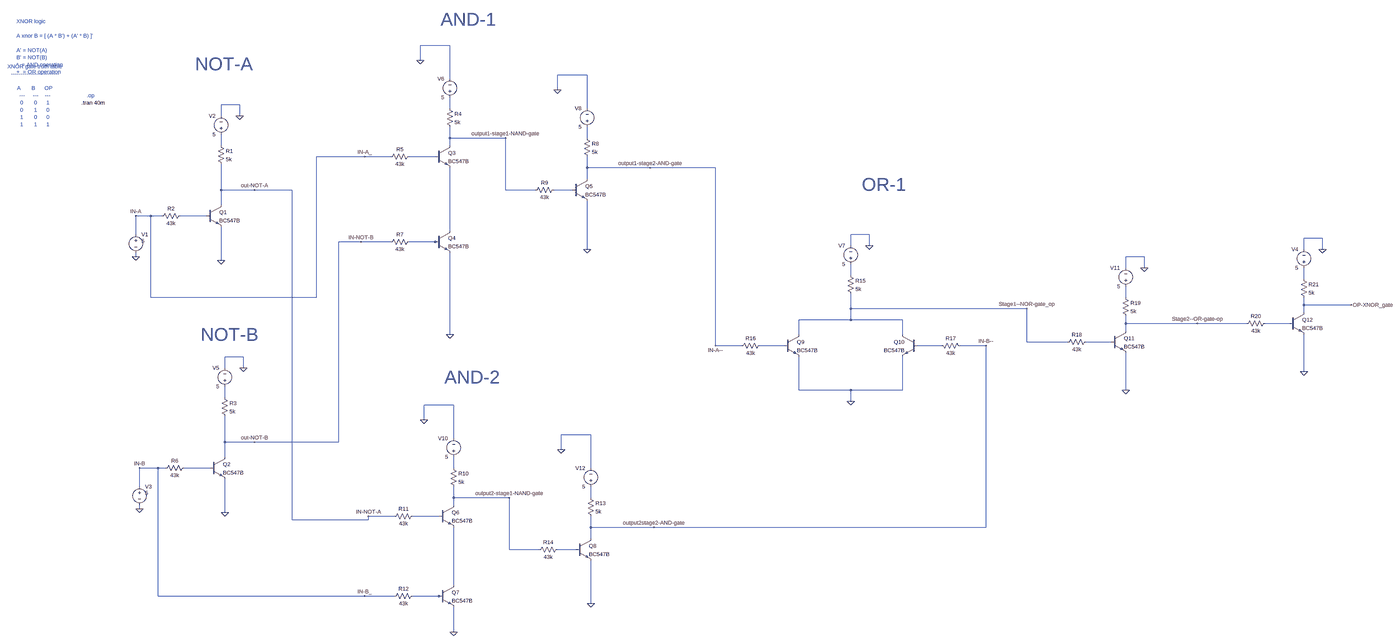
[diagram p0: schematic BJT_as_XNOR_gate.asc, whole sheet]
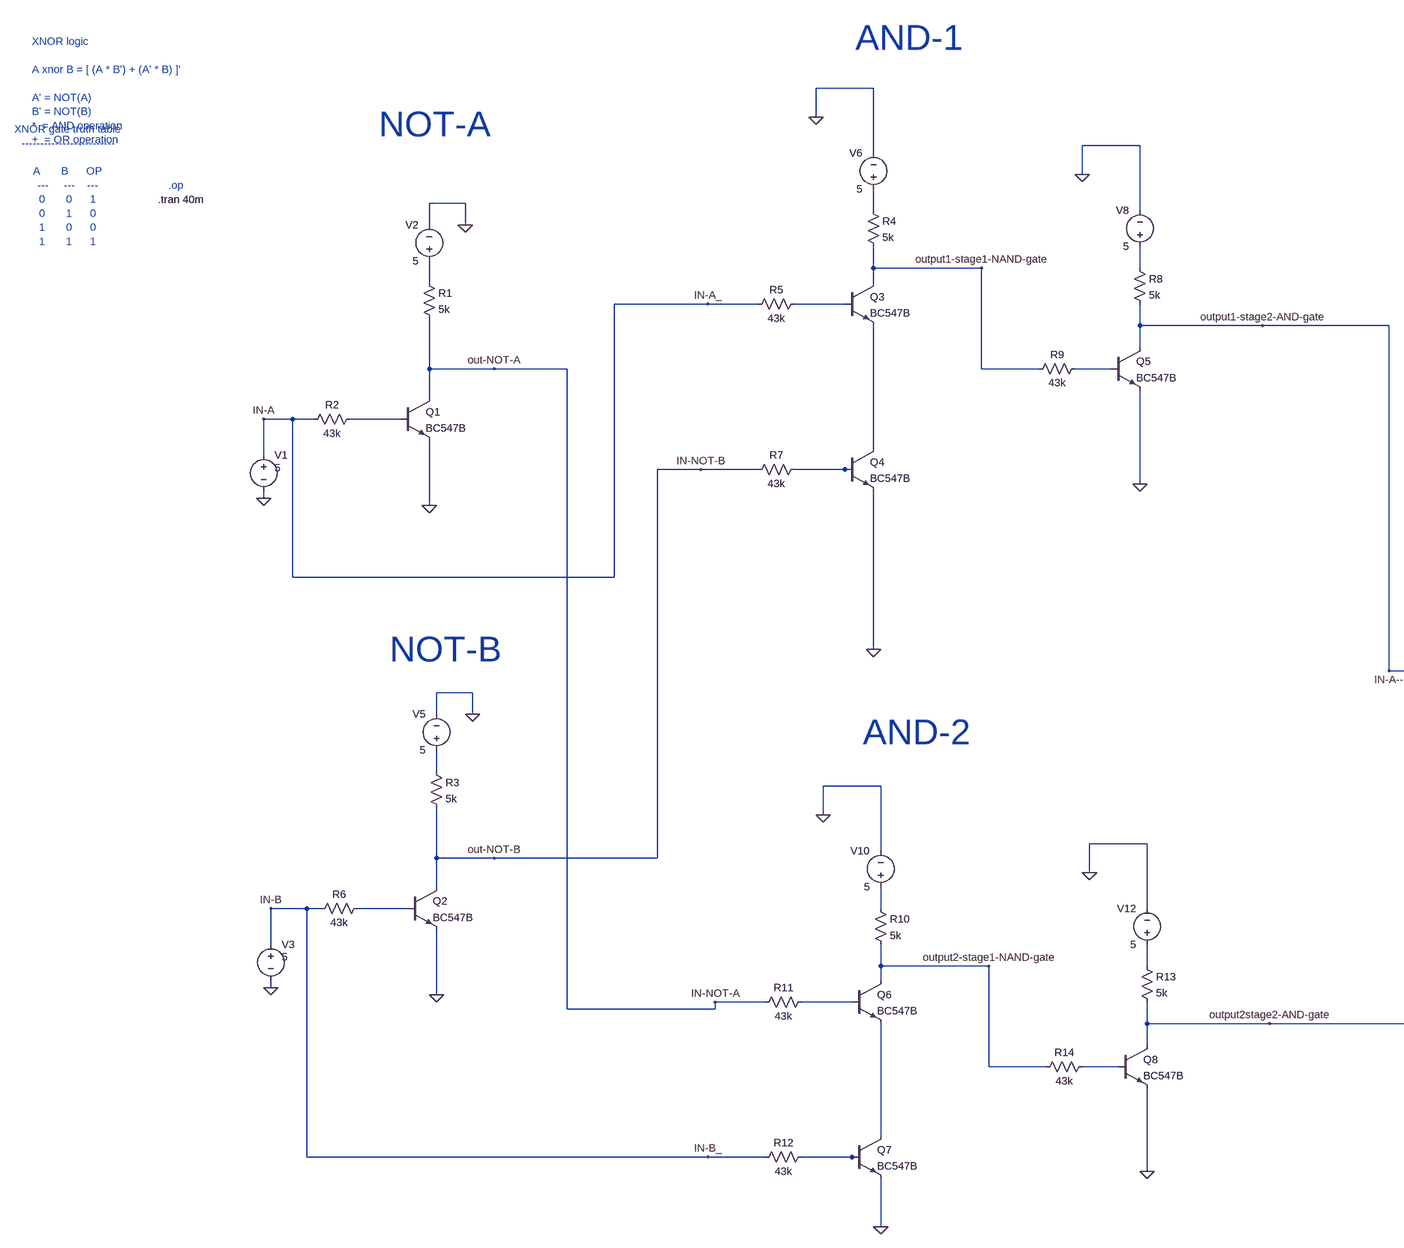
[diagram p1: schematic BJT_as_XNOR_gate.asc, part, row 1 of 1, column 1 of 2]
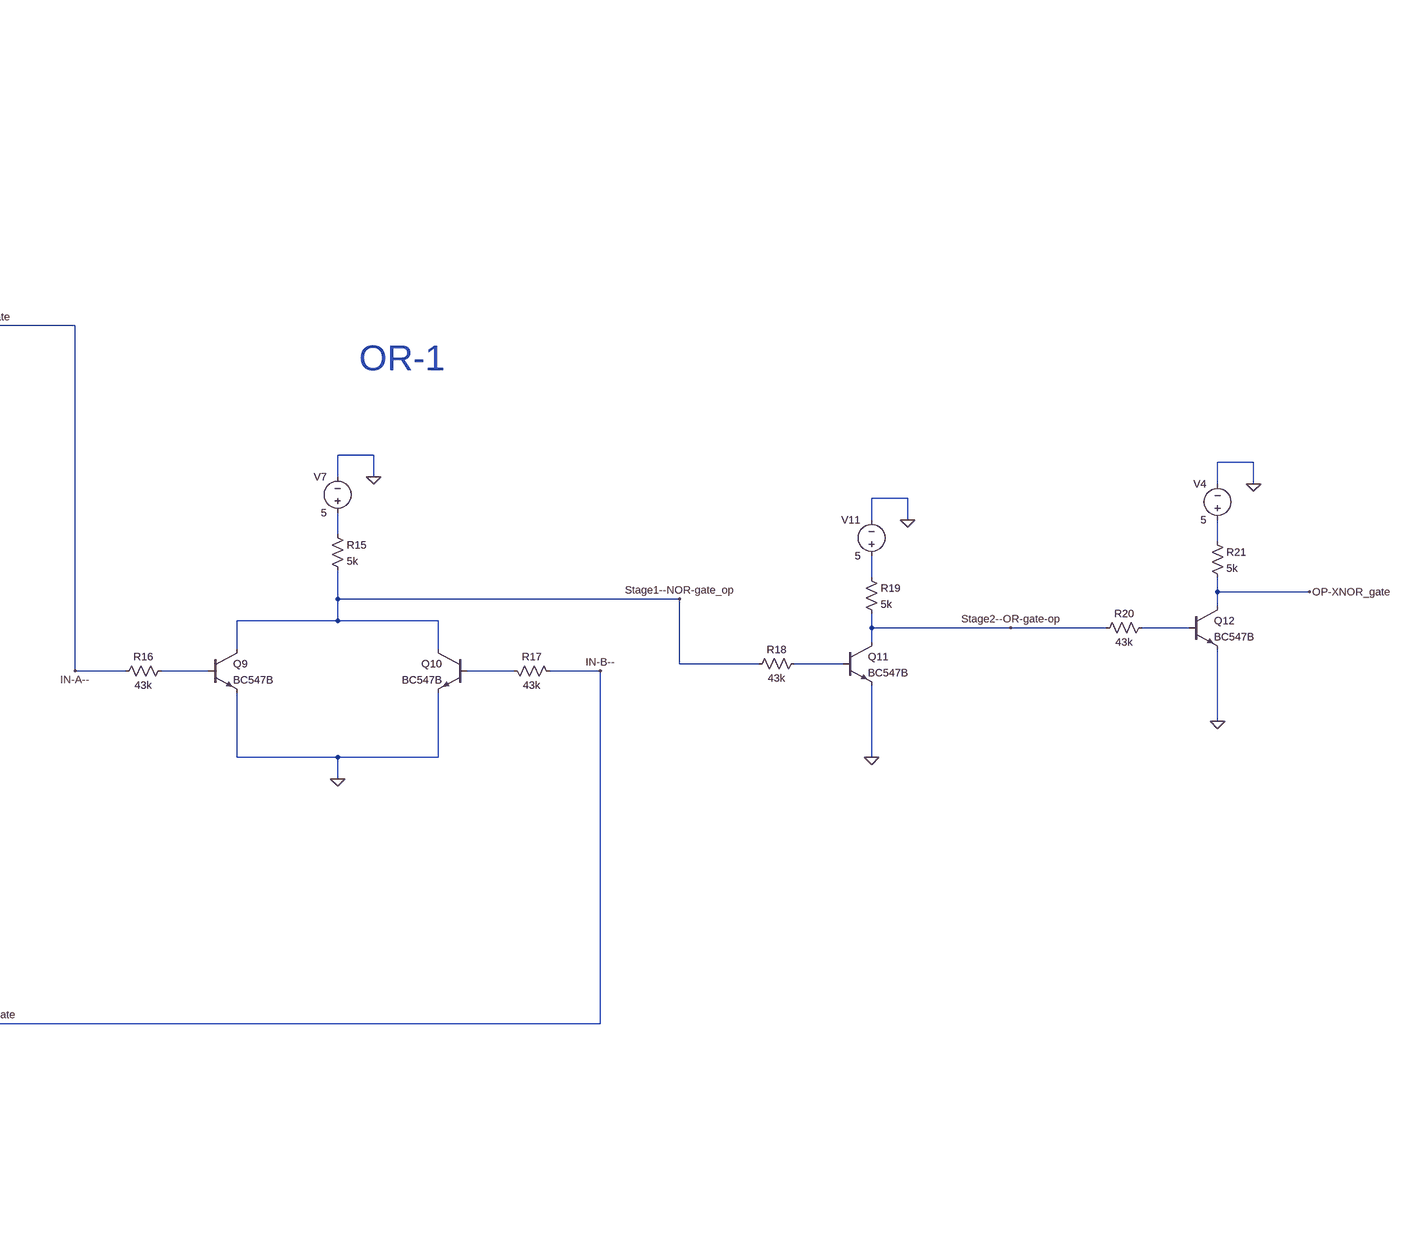
[diagram p2: schematic BJT_as_XNOR_gate.asc, part, row 1 of 1, column 2 of 2]
BJT_as_XNOR_gate.asc, the LTspice schematic file:
Version 4.1
SHEET 1 6460 2292
WIRE 1472 -528 1344 -528
WIRE 1344 -464 1344 -528
WIRE 2064 -400 1936 -400
WIRE 1472 -384 1472 -528
WIRE 1936 -336 1936 -400
WIRE 208 -272 128 -272
WIRE 1472 -256 1472 -304
WIRE 2064 -256 2064 -400
WIRE 128 -224 128 -272
WIRE 208 -224 208 -272
WIRE 1472 -128 1472 -176
WIRE 1712 -128 1472 -128
WIRE 2064 -128 2064 -176
WIRE 128 -96 128 -144
WIRE 1472 -96 1472 -128
WIRE 1104 -48 896 -48
WIRE 1216 -48 1104 -48
WIRE 1408 -48 1296 -48
WIRE 2064 0 2064 -48
WIRE 2336 0 2064 0
WIRE 2976 0 2336 0
WIRE 2064 48 2064 0
WIRE 128 96 128 -16
WIRE 272 96 128 96
WIRE 736 96 272 96
WIRE 1712 96 1712 -128
WIRE 1840 96 1712 96
WIRE 2000 96 1920 96
WIRE 128 160 128 96
WIRE -176 208 -240 208
WIRE -128 208 -176 208
WIRE 64 208 -48 208
WIRE 1472 272 1472 0
WIRE -240 288 -240 208
WIRE 3648 288 3568 288
WIRE 5952 304 5872 304
WIRE 1088 320 992 320
WIRE 1216 320 1088 320
WIRE 1408 320 1296 320
WIRE 1424 320 1408 320
WIRE 3568 336 3568 288
WIRE 3648 336 3648 288
WIRE 2064 352 2064 144
WIRE 5872 352 5872 304
WIRE 5952 352 5952 304
WIRE -240 384 -240 368
WIRE 4848 384 4768 384
WIRE 128 400 128 256
WIRE 4768 432 4768 384
WIRE 4848 432 4848 384
WIRE 3568 464 3568 416
WIRE 5872 480 5872 432
WIRE -176 560 -176 208
WIRE 896 560 896 -48
WIRE 896 560 -176 560
WIRE 4768 560 4768 512
WIRE 5872 592 5872 560
WIRE 6208 592 5872 592
WIRE 3568 608 3568 544
WIRE 4336 608 3568 608
WIRE 5872 624 5872 592
WIRE 3568 656 3568 608
WIRE 3568 656 3344 656
WIRE 3792 656 3568 656
WIRE 4768 672 4768 640
WIRE 5104 672 4768 672
WIRE 5616 672 5104 672
WIRE 5808 672 5696 672
WIRE 4768 704 4768 672
WIRE 1472 720 1472 368
WIRE 3344 720 3344 656
WIRE 3792 720 3792 656
WIRE 4336 752 4336 608
WIRE 4512 752 4336 752
WIRE 4704 752 4592 752
WIRE 2976 768 2976 0
WIRE 3088 768 2976 768
WIRE 3280 768 3168 768
WIRE 3968 768 3856 768
WIRE 4160 768 4048 768
WIRE 224 816 144 816
WIRE 144 864 144 816
WIRE 224 864 224 816
WIRE 5872 880 5872 720
WIRE 3344 960 3344 816
WIRE 3568 960 3344 960
WIRE 3792 960 3792 816
WIRE 3792 960 3568 960
WIRE 4768 960 4768 800
WIRE 144 992 144 944
WIRE 3568 1008 3568 960
WIRE 1488 1024 1360 1024
WIRE 1360 1088 1360 1024
WIRE 2080 1152 1952 1152
WIRE 1488 1168 1488 1024
WIRE 144 1184 144 1072
WIRE 272 1184 144 1184
WIRE 992 1184 992 320
WIRE 992 1184 272 1184
WIRE 1952 1216 1952 1152
WIRE 144 1248 144 1184
WIRE -144 1296 -224 1296
WIRE -112 1296 -144 1296
WIRE 80 1296 -32 1296
WIRE 1488 1296 1488 1248
WIRE 2080 1296 2080 1152
WIRE -224 1376 -224 1296
WIRE 1488 1424 1488 1376
WIRE 1728 1424 1488 1424
WIRE 2080 1424 2080 1376
WIRE 1488 1456 1488 1424
WIRE -224 1472 -224 1456
WIRE 144 1488 144 1344
WIRE 1232 1504 1120 1504
WIRE 1424 1504 1312 1504
WIRE 736 1520 736 96
WIRE 1120 1520 1120 1504
WIRE 1120 1520 736 1520
WIRE 2080 1552 2080 1504
WIRE 2352 1552 2080 1552
WIRE 4160 1552 4160 768
WIRE 4160 1552 2352 1552
WIRE 2080 1600 2080 1552
WIRE 1728 1648 1728 1424
WIRE 1856 1648 1728 1648
WIRE 2016 1648 1936 1648
WIRE 1488 1824 1488 1552
WIRE -144 1872 -144 1296
WIRE 1104 1872 -144 1872
WIRE 1232 1872 1104 1872
WIRE 1424 1872 1312 1872
WIRE 1440 1872 1424 1872
WIRE 2080 1904 2080 1696
WIRE 1488 2272 1488 1920
FLAG -240 208 IN-A
FLAG -240 384 0
FLAG 208 -224 0
FLAG 128 400 0
FLAG -224 1296 IN-B
FLAG -224 1472 0
FLAG 224 864 0
FLAG 144 1488 0
FLAG 272 96 out-NOT-A
FLAG 272 1184 out-NOT-B
FLAG 1104 -48 IN-A_
FLAG 1088 320 IN-NOT-B
FLAG 1472 720 0
FLAG 1344 -464 0
FLAG 1936 -336 0
FLAG 2064 352 0
FLAG 1712 -128 output1-stage1-NAND-gate
FLAG 2336 0 output1-stage2-AND-gate
FLAG 1120 1504 IN-NOT-A
FLAG 1104 1872 IN-B_
FLAG 1488 2272 0
FLAG 1360 1088 0
FLAG 1952 1216 0
FLAG 2080 1904 0
FLAG 1728 1424 output2-stage1-NAND-gate
FLAG 2352 1552 output2stage2-AND-gate
FLAG 2976 768 IN-A--
FLAG 4160 768 IN-B--
FLAG 3568 1008 0
FLAG 3648 336 0
FLAG 4336 608 Stage1--NOR-gate_op
FLAG 4848 432 0
FLAG 4768 960 0
FLAG 5104 672 Stage2--OR-gate-op
FLAG 5952 352 0
FLAG 5872 880 0
FLAG 6208 592 OP-XNOR_gate
SYMBOL voltage -240 272 R0
WINDOW 3 24 44 Left 2
WINDOW 123 0 0 Left 0
WINDOW 39 0 0 Left 0
SYMATTR Value 5
SYMATTR InstName V1
SYMBOL npn 64 160 R0
SYMATTR InstName Q1
SYMATTR Value BC547B
SYMBOL voltage 128 -128 R180
WINDOW 0 24 96 Left 2
WINDOW 3 24 16 Left 2
WINDOW 123 0 0 Left 0
WINDOW 39 0 0 Left 0
SYMATTR InstName V2
SYMATTR Value 5
SYMBOL res 112 -112 R0
SYMATTR InstName R1
SYMATTR Value 5k
SYMBOL res -32 192 R90
WINDOW 0 0 56 VBottom 2
WINDOW 3 32 56 VTop 2
SYMATTR InstName R2
SYMATTR Value 43k
SYMBOL voltage -224 1360 R0
WINDOW 3 24 44 Left 2
WINDOW 123 0 0 Left 0
WINDOW 39 0 0 Left 0
SYMATTR Value 5
SYMATTR InstName V3
SYMBOL npn 80 1248 R0
SYMATTR InstName Q2
SYMATTR Value BC547B
SYMBOL voltage 144 960 R180
WINDOW 0 24 96 Left 2
WINDOW 3 24 16 Left 2
WINDOW 123 0 0 Left 0
WINDOW 39 0 0 Left 0
SYMATTR InstName V5
SYMATTR Value 5
SYMBOL res 128 976 R0
SYMATTR InstName R3
SYMATTR Value 5k
SYMBOL res -16 1280 R90
WINDOW 0 0 56 VBottom 2
WINDOW 3 32 56 VTop 2
SYMATTR InstName R6
SYMATTR Value 43k
SYMBOL npn 1408 -96 R0
SYMATTR InstName Q3
SYMATTR Value BC547B
SYMBOL voltage 1472 -288 R180
WINDOW 0 24 96 Left 2
WINDOW 3 24 16 Left 2
WINDOW 123 0 0 Left 0
WINDOW 39 0 0 Left 0
SYMATTR InstName V6
SYMATTR Value 5
SYMBOL res 1456 -272 R0
SYMATTR InstName R4
SYMATTR Value 5k
SYMBOL res 1312 -64 R90
WINDOW 0 0 56 VBottom 2
WINDOW 3 32 56 VTop 2
SYMATTR InstName R5
SYMATTR Value 43k
SYMBOL npn 1408 272 R0
SYMATTR InstName Q4
SYMATTR Value BC547B
SYMBOL res 1312 304 R90
WINDOW 0 0 56 VBottom 2
WINDOW 3 32 56 VTop 2
SYMATTR InstName R7
SYMATTR Value 43k
SYMBOL npn 2000 48 R0
SYMATTR InstName Q5
SYMATTR Value BC547B
SYMBOL voltage 2064 -160 R180
WINDOW 0 24 96 Left 2
WINDOW 3 24 16 Left 2
WINDOW 123 0 0 Left 0
WINDOW 39 0 0 Left 0
SYMATTR InstName V8
SYMATTR Value 5
SYMBOL res 2048 -144 R0
SYMATTR InstName R8
SYMATTR Value 5k
SYMBOL res 1936 80 R90
WINDOW 0 0 56 VBottom 2
WINDOW 3 32 56 VTop 2
SYMATTR InstName R9
SYMATTR Value 43k
SYMBOL npn 1424 1456 R0
SYMATTR InstName Q6
SYMATTR Value BC547B
SYMBOL voltage 1488 1264 R180
WINDOW 0 24 96 Left 2
WINDOW 3 24 16 Left 2
WINDOW 123 0 0 Left 0
WINDOW 39 0 0 Left 0
SYMATTR InstName V10
SYMATTR Value 5
SYMBOL res 1472 1280 R0
SYMATTR InstName R10
SYMATTR Value 5k
SYMBOL res 1328 1488 R90
WINDOW 0 0 56 VBottom 2
WINDOW 3 32 56 VTop 2
SYMATTR InstName R11
SYMATTR Value 43k
SYMBOL npn 1424 1824 R0
SYMATTR InstName Q7
SYMATTR Value BC547B
SYMBOL res 1328 1856 R90
WINDOW 0 0 56 VBottom 2
WINDOW 3 32 56 VTop 2
SYMATTR InstName R12
SYMATTR Value 43k
SYMBOL npn 2016 1600 R0
SYMATTR InstName Q8
SYMATTR Value BC547B
SYMBOL voltage 2080 1392 R180
WINDOW 0 24 96 Left 2
WINDOW 3 24 16 Left 2
WINDOW 123 0 0 Left 0
WINDOW 39 0 0 Left 0
SYMATTR InstName V12
SYMATTR Value 5
SYMBOL res 2064 1408 R0
SYMATTR InstName R13
SYMATTR Value 5k
SYMBOL res 1952 1632 R90
WINDOW 0 0 56 VBottom 2
WINDOW 3 32 56 VTop 2
SYMATTR InstName R14
SYMATTR Value 43k
SYMBOL npn 3280 720 R0
SYMATTR InstName Q9
SYMATTR Value BC547B
SYMBOL voltage 3568 432 R180
WINDOW 0 24 96 Left 2
WINDOW 3 24 16 Left 2
WINDOW 123 0 0 Left 0
WINDOW 39 0 0 Left 0
SYMATTR InstName V7
SYMATTR Value 5
SYMBOL res 3552 448 R0
SYMATTR InstName R15
SYMATTR Value 5k
SYMBOL res 3184 752 R90
WINDOW 0 0 56 VBottom 2
WINDOW 3 32 56 VTop 2
SYMATTR InstName R16
SYMATTR Value 43k
SYMBOL npn 3856 720 M0
SYMATTR InstName Q10
SYMATTR Value BC547B
SYMBOL res 3952 752 M90
WINDOW 0 0 56 VBottom 2
WINDOW 3 32 56 VTop 2
SYMATTR InstName R17
SYMATTR Value 43k
SYMBOL npn 4704 704 R0
SYMATTR InstName Q11
SYMATTR Value BC547B
SYMBOL res 4608 736 R90
WINDOW 0 0 56 VBottom 2
WINDOW 3 32 56 VTop 2
SYMATTR InstName R18
SYMATTR Value 43k
SYMBOL voltage 4768 528 R180
WINDOW 0 24 96 Left 2
WINDOW 3 24 16 Left 2
WINDOW 123 0 0 Left 0
WINDOW 39 0 0 Left 0
SYMATTR InstName V11
SYMATTR Value 5
SYMBOL res 4752 544 R0
SYMATTR InstName R19
SYMATTR Value 5k
SYMBOL npn 5808 624 R0
SYMATTR InstName Q12
SYMATTR Value BC547B
SYMBOL res 5712 656 R90
WINDOW 0 0 56 VBottom 2
WINDOW 3 32 56 VTop 2
SYMATTR InstName R20
SYMATTR Value 43k
SYMBOL voltage 5872 448 R180
WINDOW 0 24 96 Left 2
WINDOW 3 24 16 Left 2
WINDOW 123 0 0 Left 0
WINDOW 39 0 0 Left 0
SYMATTR InstName V4
SYMATTR Value 5
SYMBOL res 5856 464 R0
SYMATTR InstName R21
SYMATTR Value 5k
TEXT -872 -280 Left 2 !.tran 40m
TEXT -848 -312 Left 2 ;.op
TEXT -1072 -312 Center 2 ;XNOR gate truth table\n-------------------------\n \nA       B      OP\n---     ---    ---\n0       0      1\n0       1      0\n1       0      0\n1       1      1
TEXT -1152 -632 Left 2 ;XNOR logic\n \nA xnor B = [ (A * B') + (A' * B) ]'\n \nA' = NOT(A)\nB' = NOT(B)\n*  = AND operation\n+  = OR operation
TEXT 1432 -640 Left 6 ;AND-1
TEXT 1448 904 Left 6 ;AND-2
TEXT 16 -448 Left 6 ;NOT-A
TEXT 40 720 Left 6 ;NOT-B
TEXT 3616 72 Left 6 ;OR-1

The netlist it stands for:
* BJT_as_XNOR_gate.asc
V1 IN-A_ 0 5
Q1 IN-NOT-A N006 0 0 BC547B
V2 N003 0 5
R1 N003 IN-NOT-A 5k
R2 N006 IN-A_ 43k
V3 IN-B_ 0 5
Q2 IN-NOT-B N017 0 0 BC547B
V5 N016 0 5
R3 N016 IN-NOT-B 5k
R6 N017 IN-B_ 43k
Q3 output1-stage1-NAND-gate N004 N007 0 BC547B
V6 N001 0 5
R4 N001 output1-stage1-NAND-gate 5k
R5 N004 IN-A_ 43k
Q4 N007 N008 0 0 BC547B
R7 N008 IN-NOT-B 43k
Q5 IN-A-- N005 0 0 BC547B
V8 N002 0 5
R8 N002 IN-A-- 5k
R9 N005 output1-stage1-NAND-gate 43k
Q6 output2-stage1-NAND-gate N020 N022 0 BC547B
V10 N018 0 5
R10 N018 output2-stage1-NAND-gate 5k
R11 N020 IN-NOT-A 43k
Q7 N022 N023 0 0 BC547B
R12 N023 IN-B_ 43k
Q8 IN-B-- N021 0 0 BC547B
V12 N019 0 5
R13 N019 IN-B-- 5k
R14 N021 output2-stage1-NAND-gate 43k
Q9 Stage1--NOR-gate_op N014 0 0 BC547B
V7 N009 0 5
R15 N009 Stage1--NOR-gate_op 5k
R16 N014 IN-A-- 43k
Q10 Stage1--NOR-gate_op N015 0 0 BC547B
R17 N015 IN-B-- 43k
Q11 Stage2--OR-gate-op N013 0 0 BC547B
R18 N013 Stage1--NOR-gate_op 43k
V11 N011 0 5
R19 N011 Stage2--OR-gate-op 5k
Q12 OP-XNOR_gate N012 0 0 BC547B
R20 N012 Stage2--OR-gate-op 43k
V4 N010 0 5
R21 N010 OP-XNOR_gate 5k
.model NPN NPN
.model PNP PNP
.lib standard.bjt
.tran 40m
* .op
* XNOR gate truth table
* -------------------------
* A       B      OP
* ---     ---    ---
* 0       0      1
* 0       1      0
* 1       0      0
* 1       1      1
* XNOR logic
* A xnor B = [ (A * B') + (A' * B) ]'
* A' = NOT(A)
* B' = NOT(B)
* *  = AND operation
* +  = OR operation
* AND-1
* AND-2
* NOT-A
* NOT-B
* OR-1
.backanno
.end